# Altium schematic sheet WaveSch.SchDoc
size A4
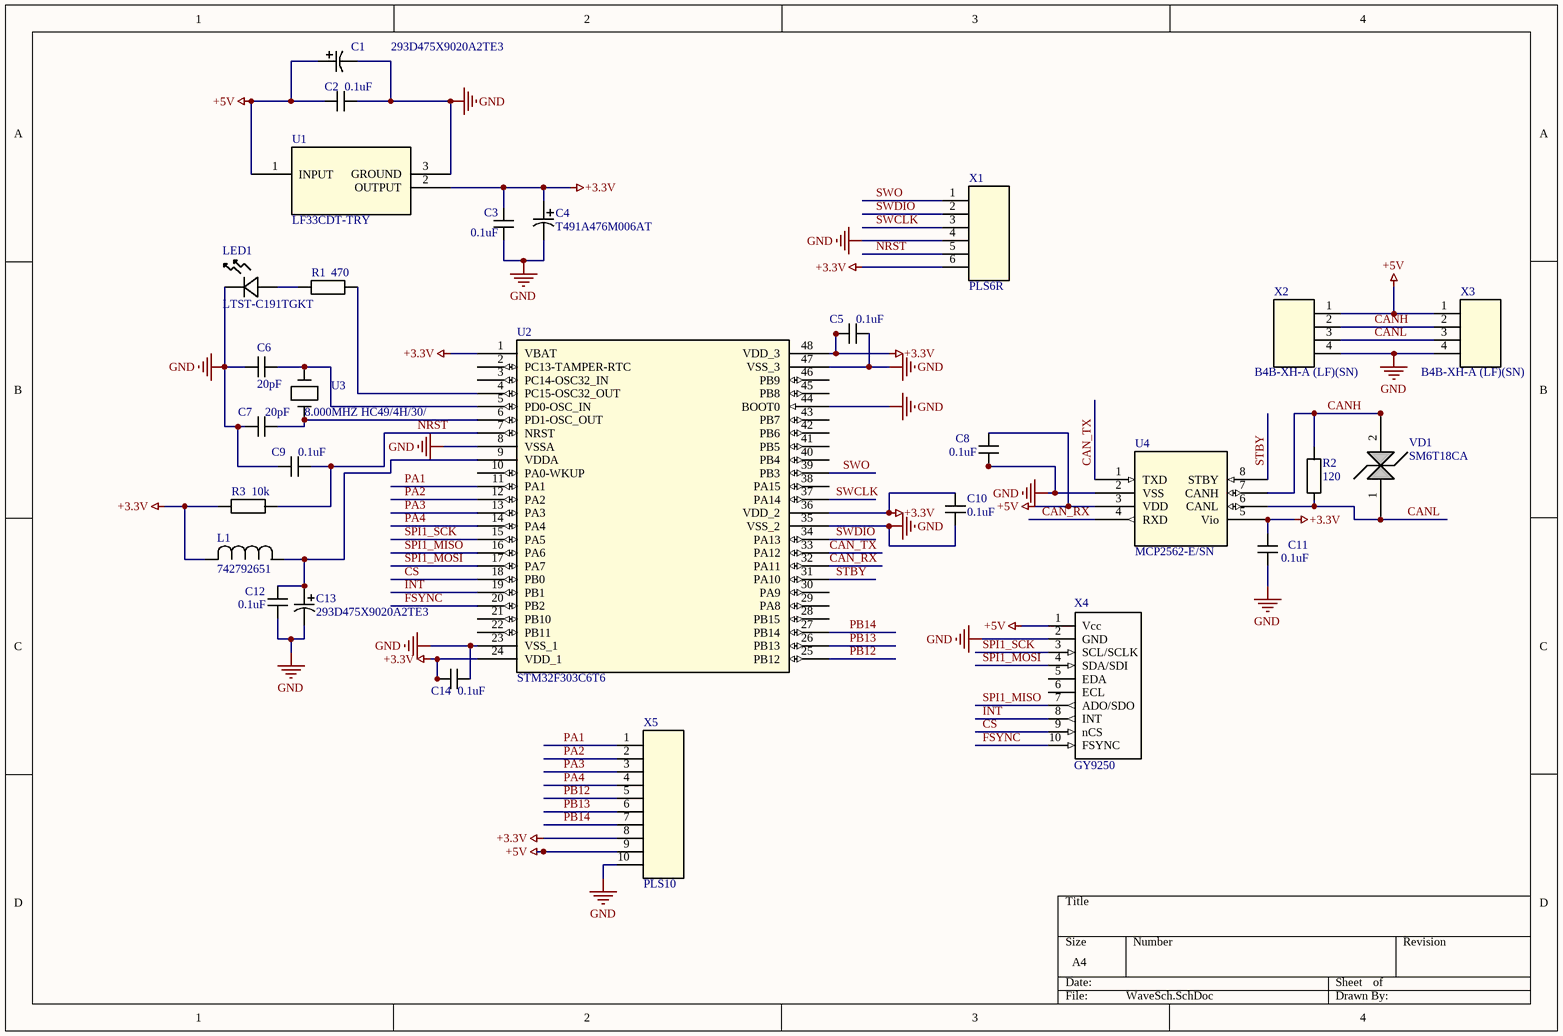
[diagram p0: WaveSch.SchDoc]

## Parts
C1  293D475X9020A2TE3  [CAPT3216N_KEM]
C2  0.1uF  [0603-L]
C3  0.1uF  [0603-L]
C4  T491A476M006AT  [CAPT3216N_KEM]
C5  0.1uF  [0603-L]
C6  20pF  [0603-L]
C7  20pF  [0603-L]
C8  0.1uF  [0603-L]
C9  0.1uF  [0603-L]
C10  0.1uF  [0603-L]
C11  0.1uF  [0603-L]
C12  0.1uF  [0603-L]
C13  293D475X9020A2TE3  [CAPT3216N_KEM]
C14  0.1uF  [0603-L]
L1  742792651  [IND_BLM18_0603]
LED1  LTST-C191TGKT  [LED_LTW-C193TS5_]
R1  470  [RC0603N]
R2  120  [RC0603N]
R3  10k  [RC0603N]
U1  LF33CDT-TRY  [DPAK_STM]
U2  STM32F303C6T6  [LQFP-48_STM]
U3  8.000MHZ HC49/4H/30/  [HC49-4H]
U4  MCP2562-E/SN  [SOIC8-N_MC_MCH]
VD1  SM6T18CA  [SMB_STM]
X1  PLS6R  [PLS-6R]
X2  B4B-XH-A (LF)(SN)  [CONN_B4B-XH-A (L]
X3  B4B-XH-A (LF)(SN)  [CONN_B4B-XH-A (L]
X4  GY9250  [GY9250]
X5  PLS10  [PLS-8]

## Nets
+3.3V: C3.2 C4.1 C5.1 C10.2 C11.2 C14.1 L1.2 R3.2 U1.2(OUTPUT) U2.1(VBAT) U2.24(VDD_1) U2.36(VDD_2) U2.48(VDD_3) U4.5(Vio) X1.6 X5.8
+5V: C1.1 C2.2 C8.2 U1.1(INPUT) U4.3(VDD) X2.1 X3.1 X4.1(Vcc) X5.9
GND: C1.2 C2.1 C3.1 C4.2 C5.2 C6.1 C7.1 C8.1 C9.1 C10.1 C11.1 C12.1 C13.2 C14.2 LED1.1 U1.3(GROUND) U2.8(VSSA) U2.23(VSS_1) U2.35(VSS_2) U2.44(BOOT0) U2.47(VSS_3) U4.2(VSS) X1.4 X2.4 X3.4 X4.2(GND) X5.10
CAN_RX: U2.32(PA11) U4.4(RXD)
CAN_TX: U2.33(PA12) U4.1(TXD)
CANH: R2.1 U4.7(CANH) VD1.2(ANODE) X2.2 X3.2
CANL: R2.2 U4.6(CANL) VD1.1(CATHODE) X2.3 X3.3
CS: U2.18(PB0) X4.9(nCS)
FSYNC: U2.20(PB2) X4.10(FSYNC)
INT: U2.19(PB1) X4.8(INT)
NRST: C9.2 R3.1 U2.7(NRST) X1.5
PA1: U2.11(PA1) X5.1
PA2: U2.12(PA2) X5.2
PA3: U2.13(PA3) X5.3
PA4: U2.14(PA4) X5.4
PB12: U2.25(PB12) X5.5
PB13: U2.26(PB13) X5.6
PB14: U2.27(PB14) X5.7
SPI1_MISO: U2.16(PA6) X4.7(ADO/SDO)
SPI1_MOSI: U2.17(PA7) X4.4(SDA/SDI)
SPI1_SCK: U2.15(PA5) X4.3(SCL/SCLK)
STBY: U2.31(PA10) U4.8(STBY)
SWCLK: U2.37(PA14) X1.3
SWDIO: U2.34(PA13) X1.2
SWO: U2.39(PB3) X1.1
NetC6_2: C6.2 U2.5(PD0-OSC_IN) U3.2
NetC7_2: C7.2 U2.6(PD1-OSC_OUT) U3.1
NetC12_2: C12.2 C13.1 L1.1 U2.9(VDDA)
NetLED1_2: LED1.2 R1.2
NetR1_1: R1.1 U2.4(PC15-OSC32_OUT)

Not connected (* = marked no-connect by the designer): U2 2(PC13-TAMPER-RTC) 3(PC14-OSC32_IN) 10(PA0-WKUP) 21(PB10) 22(PB11) 28(PB15) 29(PA8) 30(PA9) 38(PA15) 40(PB4) 41(PB5) 42(PB6) 43(PB7) 45(PB8) 46(PB9); X4 5(EDA) 6(ECL)

## Library data of the parts
C1 C4 C13 = T491A476M006AT: No Description Available; Vendor: Kemet; Built_By: EMA_UL_Team; SourceLibrary: Kemet_2012-01-01_Caps1_2; Type: DEV; Manufacturer_Part_Number: T491A476M006AT; Copyright: Copyright (C) 2018 Accelerated Designs. All rights reserved; RefDes: RefDes; Value: Value
C2 C3 C5-C12 C14 = 0603ZC224JAT2A: No Description Available; Vendor: AVX Corporation; Built_By: EMA_UL_Team; Type: DEV; Manufacturer_Part_Number: 0603ZC224JAT2A; Copyright: Copyright (C) 2018 Accelerated Designs. All rights reserved; RefDes: RefDes; Value: Value
L1 = BLM18BB331SN1D: No Description Available; Vendor: MURATA; Built_By: EMA_UL_Team; Type: DEV; Manufacturer_Part_Number: BLM18BB331SN1D; Copyright: Copyright (C) 2018 Accelerated Designs. All rights reserved; RefDes: RefDes; Value: Value
LED1 = LTST-C191TGKT: No Description Available; Built_By: EMA_Justin; Vendor: Lite-On; SourceLibrary: Lite_On_2018-12-15; Type: DEV; Copyright: Copyright (C) 2016 Accelerated Designs. All rights reserved; Manufacturer_Part_Number: LTST-C191TGKT; RefDes: RefDes; Value: Value
R1-R3 = ERA-3AEB101V: No Description Available; Vendor: Panasonic; Built_By: EMA_UL_Team; Manufacturer_Part_Number: ERA-3AEB101V; Copyright: Copyright (C) 2018 Accelerated Designs. All rights reserved; RefDes: RefDes; Type: DEV; Value: Value
U1 = LF33CDT-TRY: No Description Available; SourceLibrary: StMicro_2015-03-30; Built_By: EMA_UL_Team; Vendor: STMicroelectronics; Manufacturer_Part_Number: LF33CDT-TRY; Copyright: Copyright (C) 2018 Accelerated Designs. All rights reserved; RefDes: RefDes; Type: DEV
U2 = STM32F303CCT6: No Description Available; Manufacturer_Part_Number: STM32F303CBT6; SourceLibrary: StMicro_2015-03-30; Built_By: EMA_UL_Team; Vendor: STMicroelectronics; Copyright: Copyright (C) 2018 Accelerated Designs. All rights reserved; RefDes: RefDes; Type: DEV; Link: https://www.promelec.ru/product/241316/
U3 = 8.000MHZ HC49/4H: No Description Available; Vendor: Euroquartz; Built_By: EMA_UL_Team; SourceLibrary: Euroquartz_2010-01-01; Manufacturer_Part_Number: 8.000MHZ HC49/4H/30/; Copyright: Copyright (C) 2018 Accelerated Designs. All rights reserved; RefDes: RefDes; Type: DEV; Link: ------------
U4 = MCP2562FD-E/SN: No Description Available; Vendor: Microchip; Built_By: EMA_Jessica; SourceLibrary: Microchip_2019-08-23_14; Manufacturer_Part_Number: MCP2562FD-E/SN; Copyright: Copyright (C) 2018 Accelerated Designs. All rights reserved; RefDes: RefDes; Type: DEV
VD1 = SM6T18CA: No Description Available; Manufacturer_Part_Number: LXES1UTAA1-157; Vendor: Toshiba; Built_By: EMA_UL_Team; SourceLibrary: Murata; Copyright: Copyright (C) 2018 Accelerated Designs. All rights reserved; RefDes: RefDes; Type: Type; Value: Value; Link: https://www.digikey.com/product-detail/en/toshiba-semiconductor-and-storage/DF2S5-6CT-L3F/DF2S5-6CTL3FCT-ND/5810250
X1 X5 = PLS6R: No Description Available; Vendor: JST; Built_By: EMA_UL_Team; Copyright: Copyright (C) 2018 Accelerated Designs. All rights reserved; RefDes: RefDes; Type: DEV; Value: Value
  X1: Manufacturer_Part_Number: PLS6R
  X5: Manufacturer_Part_Number: PLS10
X2 X3 = B4B-XH-A (LF)(SN: No Description Available; Vendor: JST; Built_By: EMA_Cory; Datasheet: http://www.jst-mfg.com/product/pdf/eng/eXH.pdf; Manufacturer_Part_Number: B4B-XH-A (LF)(SN); Copyright: Copyright (C) 2018 Accelerated Designs. All rights reserved; RefDes: RefDes; Type: DEV; Value: Value